# Altium schematic sheet [3]-RK3399 EDP_CSI_HDMI.SchDoc: RK3399 SOM Board Design V1.0
size A4; Author: AVIRAL MISHRA; DocumentNumber: 4; SheetNumber: 4; SheetTotal: 12; PROJECT CODE: A_V1.0
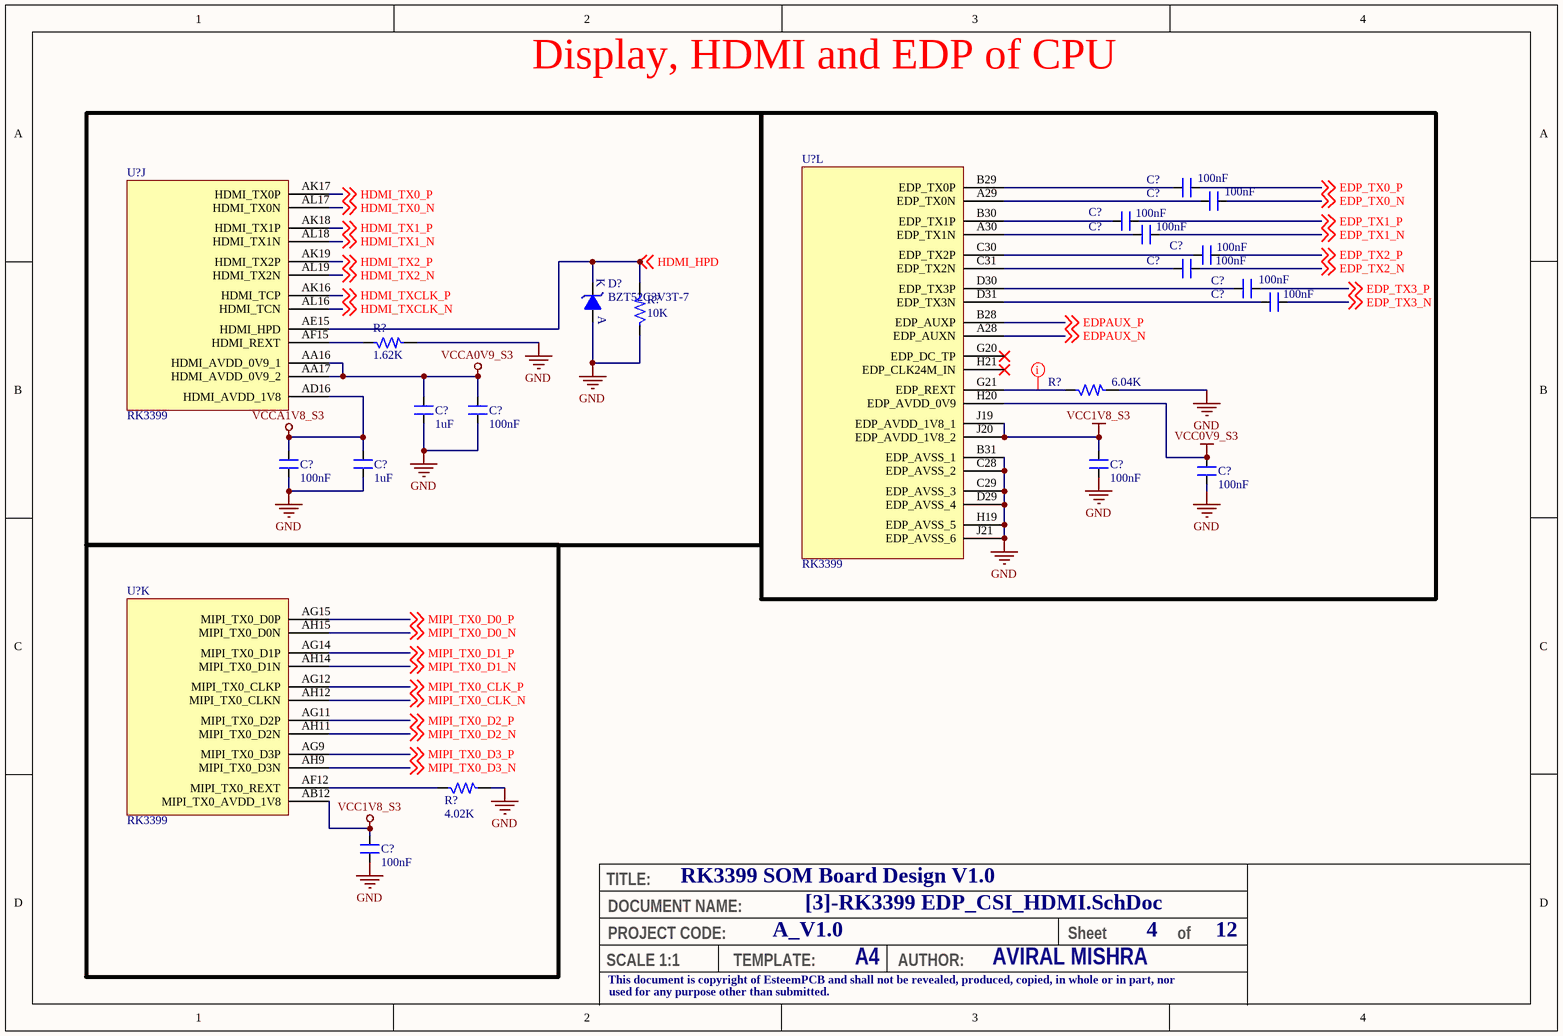
[diagram p0: [3]-RK3399 EDP_CSI_HDMI.SchDoc]

## Parts
(Parts that share a designator on the sheet are numbered #1, #2 ... from top to bottom, then left to right.)
C?#1  100nF  [CAP_0201]
C?#2  100nF  [CAP_0201]
C?#3  100nF  [CAP_0201]
C?#4  100nF  [CAP_0201]
C?#5  100nF  [CAP_0201]
C?#6  100nF  [CAP_0201]
C?#7  100nF  [CAP_0201]
C?#8  100nF  [CAP_0201]
C?#9  1uF  [CAP_0201]
C?#10  100nF  [CAP_0201]
C?#11  100nF  [CAP_0201]
C?#12  1uF  [CAP_0201]
C?#13  100nF  [CAP_0201]
C?#14  100nF  [CAP_0201]
C?#15  100nF  [CAP_0201]
D?  BZT52C3V3T-7  [DIO_SOD523]
R?#1  10K  [RES_0201]
R?#2  1.62K  [RES_0201]
R?#3  6.04K  [RES_0201]
R?#4  4.02K  [RES_0201]
U?#1  RK3399  [FBGA828_23_826X826]  (part L of 24)
U?#2  RK3399  [FBGA828_23_826X826]  (part J of 24)
U?#3  RK3399  [FBGA828_23_826X826]  (part K of 24)

## Nets
GND: C?#9.1 C?#10.1 C?#11.1 C?#12.1 C?#13.2 C?#14.1 C?#15.1 D?.A R?#1.1 R?#2.2 R?#3.2 R?#4.2 U?#1.B31(EDP_AVSS_1) U?#1.C28(EDP_AVSS_2) U?#1.C29(EDP_AVSS_3) U?#1.D29(EDP_AVSS_4) U?#1.H19(EDP_AVSS_5) U?#1.J21(EDP_AVSS_6)
VCC0V9_S3: C?#14.2 U?#1.H20(EDP_AVDD_0V9)
VCC1V8_S3: C?#13.1 C?#15.2 U?#1.J19(EDP_AVDD_1V8_1) U?#1.J20(EDP_AVDD_1V8_2) U?#3.AB12(MIPI_TX0_AVDD_1V8)
VCCA0V9_S3: C?#9.2 C?#10.2 U?#2.AA16(HDMI_AVDD_0V9_1) U?#2.AA17(HDMI_AVDD_0V9_2)
VCCA1V8_S3: C?#11.2 C?#12.2 U?#2.AD16(HDMI_AVDD_1V8)
EDP_TX0_N: C?#2.1 ; off-sheet EDP_TX0_N
EDP_TX0_P: C?#1.1 ; off-sheet EDP_TX0_P
EDP_TX1_N: C?#4.1 ; off-sheet EDP_TX1_N
EDP_TX1_P: C?#3.1 ; off-sheet EDP_TX1_P
EDP_TX2_N: C?#6.1 ; off-sheet EDP_TX2_N
EDP_TX2_P: C?#5.1 ; off-sheet EDP_TX2_P
EDP_TX3_N: C?#8.1 ; off-sheet EDP_TX3_N
EDP_TX3_P: C?#7.1 ; off-sheet EDP_TX3_P
EDPAUX_N: U?#1.A28(EDP_AUXN) ; off-sheet EDPAUX_N
EDPAUX_P: U?#1.B28(EDP_AUXP) ; off-sheet EDPAUX_P
HDMI_HPD: D?.K R?#1.2 U?#2.AE15(HDMI_HPD) ; off-sheet HDMI_HPD
HDMI_TX0_N: U?#2.AL17(HDMI_TX0N) ; off-sheet HDMI_TX0_N
HDMI_TX0_P: U?#2.AK17(HDMI_TX0P) ; off-sheet HDMI_TX0_P
HDMI_TX1_N: U?#2.AL18(HDMI_TX1N) ; off-sheet HDMI_TX1_N
HDMI_TX1_P: U?#2.AK18(HDMI_TX1P) ; off-sheet HDMI_TX1_P
HDMI_TX2_N: U?#2.AL19(HDMI_TX2N) ; off-sheet HDMI_TX2_N
HDMI_TX2_P: U?#2.AK19(HDMI_TX2P) ; off-sheet HDMI_TX2_P
HDMI_TXCLK_N: U?#2.AL16(HDMI_TCN) ; off-sheet HDMI_TXCLK_N
HDMI_TXCLK_P: U?#2.AK16(HDMI_TCP) ; off-sheet HDMI_TXCLK_P
MIPI_TX0_CLK_N: U?#3.AH12(MIPI_TX0_CLKN) ; off-sheet MIPI_TX0_CLK_N
MIPI_TX0_CLK_P: U?#3.AG12(MIPI_TX0_CLKP) ; off-sheet MIPI_TX0_CLK_P
MIPI_TX0_D0_N: U?#3.AH15(MIPI_TX0_D0N) ; off-sheet MIPI_TX0_D0_N
MIPI_TX0_D0_P: U?#3.AG15(MIPI_TX0_D0P) ; off-sheet MIPI_TX0_D0_P
MIPI_TX0_D1_N: U?#3.AH14(MIPI_TX0_D1N) ; off-sheet MIPI_TX0_D1_N
MIPI_TX0_D1_P: U?#3.AG14(MIPI_TX0_D1P) ; off-sheet MIPI_TX0_D1_P
MIPI_TX0_D2_N: U?#3.AH11(MIPI_TX0_D2N) ; off-sheet MIPI_TX0_D2_N
MIPI_TX0_D2_P: U?#3.AG11(MIPI_TX0_D2P) ; off-sheet MIPI_TX0_D2_P
MIPI_TX0_D3_N: U?#3.AH9(MIPI_TX0_D3N) ; off-sheet MIPI_TX0_D3_N
MIPI_TX0_D3_P: U?#3.AG9(MIPI_TX0_D3P) ; off-sheet MIPI_TX0_D3_P
NetC?#1_2: C?#1.2 U?#1.B29(EDP_TX0P)
NetC?#2_2: C?#2.2 U?#1.A29(EDP_TX0N)
NetC?#3_2: C?#3.2 U?#1.B30(EDP_TX1P)
NetC?#4_2: C?#4.2 U?#1.A30(EDP_TX1N)
NetC?#5_2: C?#5.2 U?#1.C30(EDP_TX2P)
NetC?#6_2: C?#6.2 U?#1.C31(EDP_TX2N)
NetC?#7_2: C?#7.2 U?#1.D30(EDP_TX3P)
NetC?#8_2: C?#8.2 U?#1.D31(EDP_TX3N)
NetR?#2_1: R?#2.1 U?#2.AF15(HDMI_REXT)
NetR?#3_1: R?#3.1 U?#1.G21(EDP_REXT)
NetR?#4_1: R?#4.1 U?#3.AF12(MIPI_TX0_REXT)

Not connected (* = marked no-connect by the designer): U?#1 G20(EDP_DC_TP)* H21(EDP_CLK24M_IN)*

## Layout directives
net class EDP_GROUP: NetR?#3_1

## Notes on the sheet
- Display, HDMI and EDP of CPU
- TITLE:
- DOCUMENT NAME:
- SCALE 1:1
- This document is copyright of EsteemPCB and shall not be revealed, produced, copied, in whole or in part, nor
- PROJECT CODE:
- TEMPLATE:
- A4
- AUTHOR:
- Sheet
- of
- used for any purpose other than submitted.

## Library data of the parts
C?#1-C?#8 C?#10 C?#11 C?#13-C?#15 = CAP_100nF-25V-10%-0201: 0.1µF ±10% 25V Ceramic Capacitor X5R 0201 (0603 Metric) /; Manufacturer: TDK Corporation; Manufacturer Part Number: C0603X5R1E104K030BB; Case/Package: 0201; Supplier-1: Digikey
C?#9 C?#12 = CAP_1uF-16V-10%-0201: 1µF ±20% 16V Ceramic Capacitor X5R 0201 (0603 Metric) /; Manufacturer: Samsung Electro-Mechanics; Manufacturer Part Number: CL03A105MO3NRNH; Case/Package: 0201; Supplier-1: Digikey
D? = DIO-Z_3.3V-300mW-SOD-523: Zener Diode 3.3V 300mW ±6% Surface Mount SOD-523 /; Manufacturer: Diodes Incorporated; Manufacturer Part Number: BZT52C3V3T-7; Case/Package: SOD523; Supplier-1: Digikey
R?#1 = RES_10K-0.05W-1%-0201: 10 kOhms ±1% 0.05W, 1/20W Chip Resistor 0201 (0603 Metric) Thick Film /; Manufacturer: Stackpole Electronics Inc; Manufacturer Part Number: RMCF0201FT10K0; Case/Package: 0201; Supplier-1: Digikey
R?#2 = RES_1.62K-0.05W-1%-0201: 1.62 kOhms ±1% 0.05W, 1/20W Chip Resistor 0201 (0603 Metric) Automotive AEC-Q200 Thick Film /; Manufacturer: Panasonic Electronic Components; Manufacturer Part Number: ERJ-1GNF1621C; Case/Package: 0201; Supplier-1: Digikey
R?#3 = RES_6.04K-0.05W-1%-0201: 6.04 kOhms ±1% 0.05W, 1/20W Chip Resistor 0201 (0603 Metric) Thick Film /; Manufacturer: Panasonic Electronic Components; Manufacturer Part Number: ERJ-1GEF6041C; Case/Package: 0201; Supplier-1: Digikey
R?#4 = RES_4.02K-0.05W-1%-0201: 4.02 kOhms ±1% 0.05W, 1/20W Chip Resistor 0201 (0603 Metric) Thick Film /; Manufacturer: Yageo; Manufacturer Part Number: RC0201FR-074K02L; Case/Package: 0201; Supplier-1: Digikey
U?#1-U?#3 = IC_RK3399-FCBGA828: RK3399 is a low power, high performance processor for computing, personal mobile.; Manufacturer: Rockchip; Manufacturer Part Number: RK3399; Case/Package: FCBGA828; Supplier-1: Rockchip